# EAGLE design TV-B-Gone (EAGLE 7.5.0)
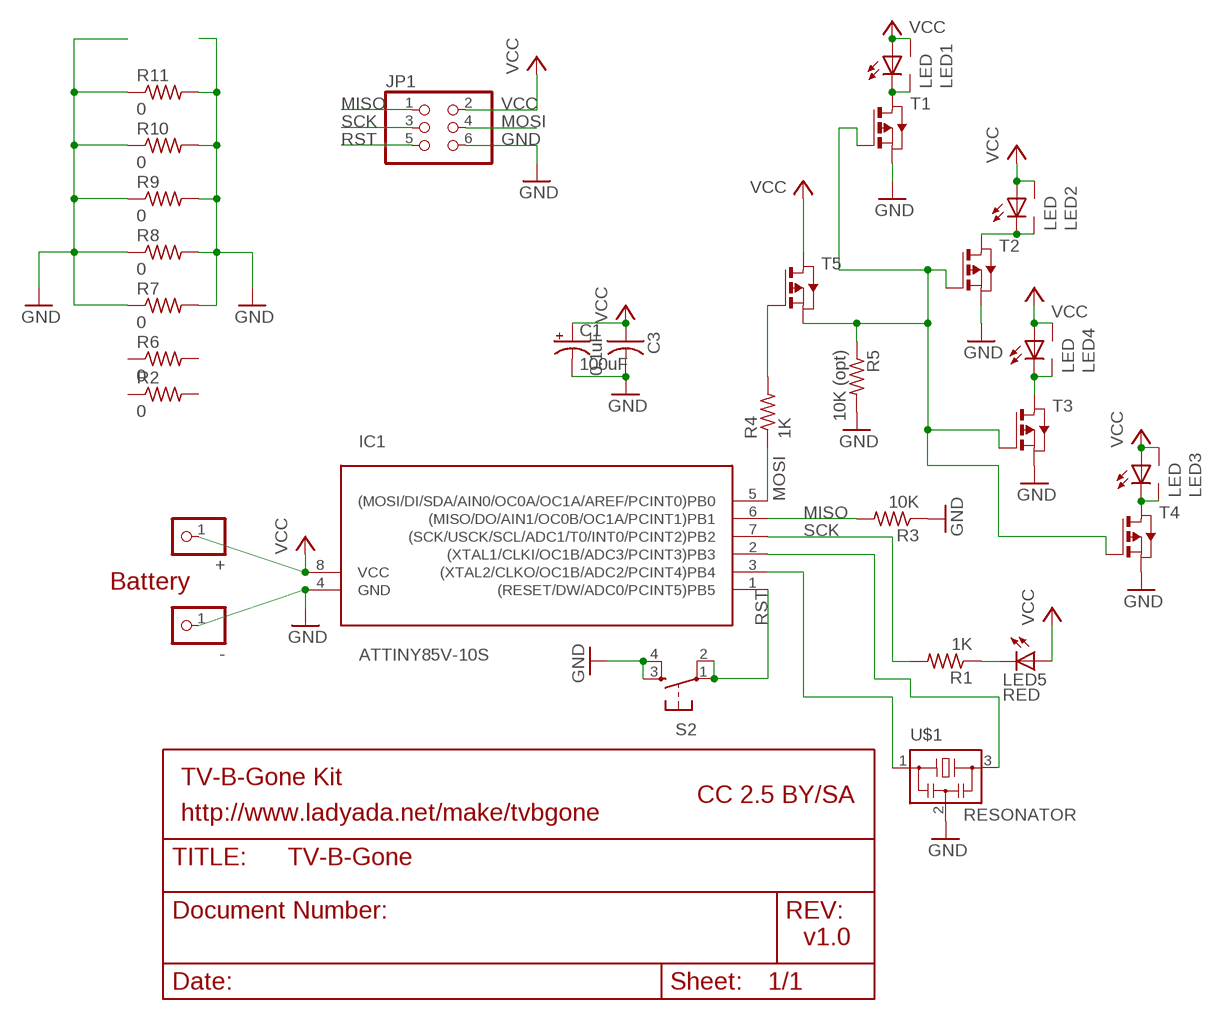
[diagram p0: schematic, sheet 1]

## Parts
+  PINHD-1X1  [1X01]
-  PINHD-1X1  [1X01]
C1  100uF  CAP_POLE  [PANASONIC_E]
C3  0.1uF  CAP-US1206FAB  [C1206FAB]
IC1  ATTINY85V-10S  [SOIC8]
JP1  PINHD-2X3-SMD  [2X03SMD]
LED1  LED  [5MM-SIDE]
LED2  LED  [5MM-SIDE]
LED3  LED  [5MM-SIDE]
LED4  LED  [5MM-SIDE]
LED5  RED  LEDCHIPLED_1206  [CHIPLED_1206]
R1  1K  RES-US1206FAB  [R1206FAB]
R2  0  RES-US1206FAB  [R1206FAB]
R3  10K  RES-US1206FAB  [R1206FAB]
R4  1K  RES-US1206FAB  [R1206FAB]
R5  10K (opt)  RES-US1206FAB  [R1206FAB]
R6  0  RES-US1206FAB  [R1206FAB]
R7  0  RES-US1206FAB  [R1206FAB]
R8  0  RES-US1206FAB  [R1206FAB]
R9  0  RES-US1206FAB  [R1206FAB]
R10  0  RES-US1206FAB  [R1206FAB]
R11  0  RES-US1206FAB  [R1206FAB]
S2  6MM_SWITCH6MM_SWITCH  [6MM_SWITCH]
T1  PMOSFETSOT23  [SOT-23]
T2  PMOSFETSOT23  [SOT-23]
T3  PMOSFETSOT23  [SOT-23]
T4  PMOSFETSOT23  [SOT-23]
T5  PMOSFETSOT23  [SOT-23]
U$1  RESONATOR  [EFOBM]

## Nets
GND: -.1 C1.- C3.2 IC1.4(GND) JP1.6 R3.1 R5.2 R7.1 R7.2 R8.1 R8.2 R9.1 R9.2 R10.1 R10.2 R11.1 R11.2 S2.3(S) S2.4(S1) T1.2(S) T2.2(S) T3.2(S) T4.2(S) U$1.2
MISO: IC1.6((MISO/DO/AIN1/OC0B/OC1A/PCINT1)PB1) JP1.1 R3.2
MOSI: IC1.5((MOSI/DI/SDA/AIN0/OC0A/OC1A/AREF/PCINT0)PB0) JP1.4 R4.1
N$1: IC1.3((XTAL2/CLKO/OC1B/ADC2/PCINT4)PB4) U$1.1
N$2: IC1.2((XTAL1/CLKI/OC1B/ADC3/PCINT3)PB3) U$1.3
N$3: LED5.C R1.1
N$6: R4.2 T5.3(G)
N$7: LED4.K2(C1) LED4.K(C) T3.1(D)
N$8: LED2.K2(C1) LED2.K(C) T2.1(D)
N$9: LED3.K2(C1) LED3.K(C) T4.1(D)
N$10: R5.1 T1.3(G) T2.3(G) T3.3(G) T4.3(G) T5.2(S)
N$11: LED1.K2(C1) LED1.K(C) T1.1(D)
RST: IC1.1((RESET/DW/ADC0/PCINT5)PB5) JP1.5 S2.1(P) S2.2(P1)
SCK: IC1.7((SCK/USCK/SCL/ADC1/T0/INT0/PCINT2)PB2) JP1.3 R1.2
VCC: +.1 C1.+ C3.1 IC1.8(VCC) JP1.2 LED1.A LED1.A2(A1) LED2.A LED2.A2(A1) LED3.A LED3.A2(A1) LED4.A LED4.A2(A1) LED5.A T5.1(D)
Unconnected: R2.1 R2.2 R6.1 R6.2

## Notes on the sheet
- Battery
- TV-B-Gone Kit
- CC 2.5 BY/SA
- http://www.ladyada.net/make/tvbgone
- v1.0

## Library data of the parts
+ - = ybox2:PINHD-1X1: PIN HEADER
C1 = SparkFun-Capacitors:CAP_POL: Capacitor Polarized These are standard SMD and PTH capacitors. Normally 10uF, 47uF, and 100uF in electrolytic and tantalum varieties. Always verify the external diameter of the through hole cap, it varies with capacity, voltage, and manufacturer. The EIA devices should be standard.
C3 = fab:CAP-US
IC1 = avr:ATTINY85: MICROCONTROLLER 8 Kbytes FLASH 512 bytes EEPROM 512 bytes RAM 4-channel 10 bit ADC USI
JP1 = fab:PINHD-2X3-SMD: PIN HEADER
LED1-LED4 = tvbgone:LED
LED5 = minimidi:LED: LED OSRAM: - CHIPLED LG R971, LG N971, LY N971, LG Q971, LY Q971, LO R971, LY R971 LH N974, LH R974 LS Q976, LO Q976, LY Q976 LO Q996 - Hyper CHIPLED LW Q18S LB Q993, LB Q99A, LB R99A - SideLED LS A670, LO A670, LY A670, LG A670, LP A670 LB A673, LV A673, LT A673, LW A673 LH A674 LY A675 LS A676, LA A676, LO A676, LY A676, LW A676 LS A679, LY A679, LG A679 - Hyper Micro SIDELED® LS Y876, LA Y876, LO Y876, LY Y876 LT Y87S - SmartLED LW L88C, LW L88S LB L89C, LB L89S, LG L890 LS L89K, LO L89K, LY L89K LS L896, LA L896, LO L896, LY L896 - TOPLED LS T670, LO T670, LY T670, LG T670, LP T670 LSG T670, LSP T670, LSY T670, LOP T670, LYG T670 LG T671, LOG T671, LSG T671 LB T673, LV T673, LT T673, LW T673 LH T674 LS T676, LA T676, LO T676, LY T676, LB T676, LH T676, LSB T676, LW T676 LB T67C, LV T67C, LT T67C, LS T67K, LO T67K, LY T67K, LW E67C LS E67B, LA E67B, LO E67B, LY E67B, LB E67C, LV E67C, LT E67C LW T67C LS T679, LY T679, LG T679 LS T770, LO T770, LY T770, LG T770, LP T770 LB T773, LV T773, LT T773, LW T773 LH T774 LS E675, LA E675, LY E675, LS T675 LS T776, LA T776, LO T776, LY T776, LB T776 LHGB T686 LT T68C, LB T68C - Hyper Mini TOPLED® LB M676 - Mini TOPLED Santana® LG M470 LS M47K, LO M47K, LY M47K Source: http://www.osram.convergy.de/
R1-R11 = fab:RES-US: Resistor (US Symbol) Variants with postfix FAB are widened to allow the routing of internal traces
S2 = fab:6MM_SWITCH: OMRON SWITCH
T1-T5 = fab:PMOSFET: MOS FET
U$1 = fab:RESONATOR

## Board
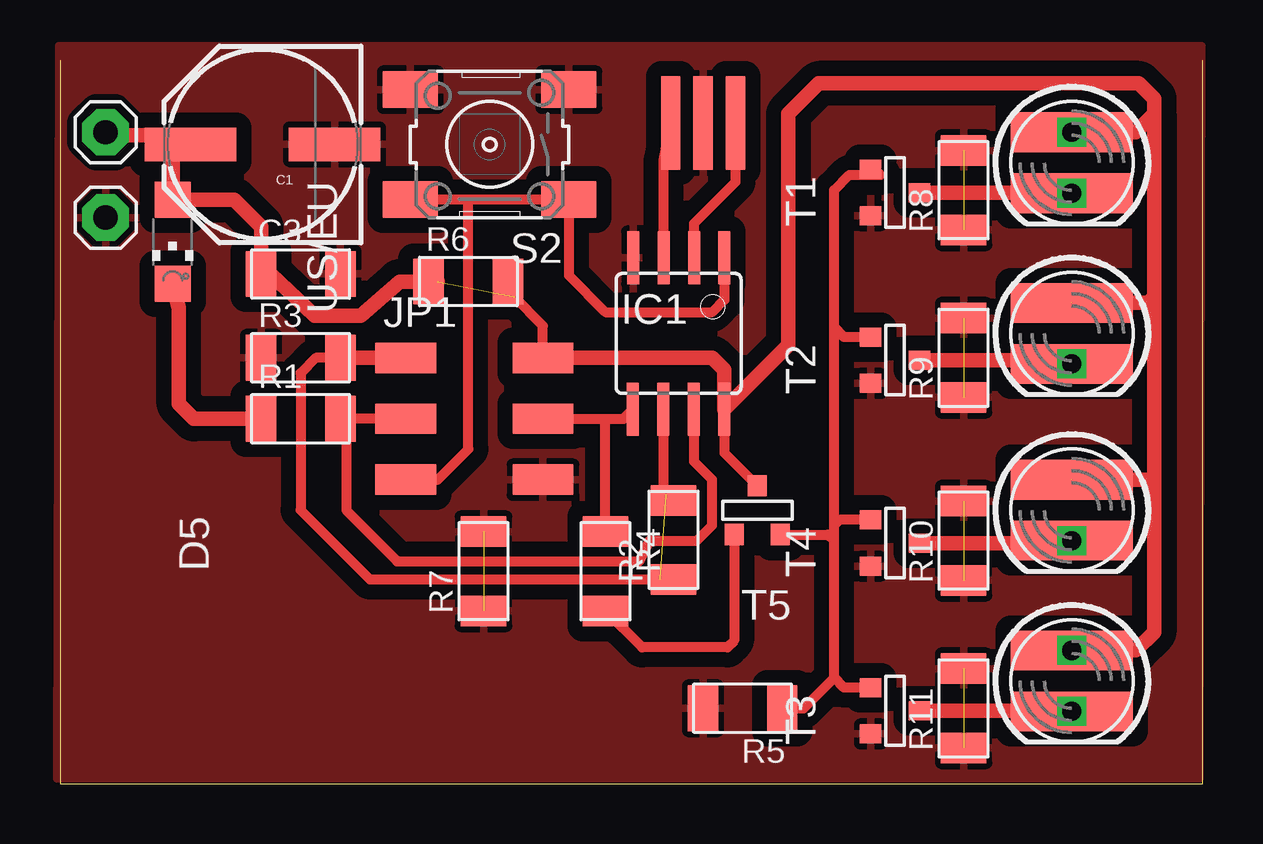
[diagram p1: board, top side]
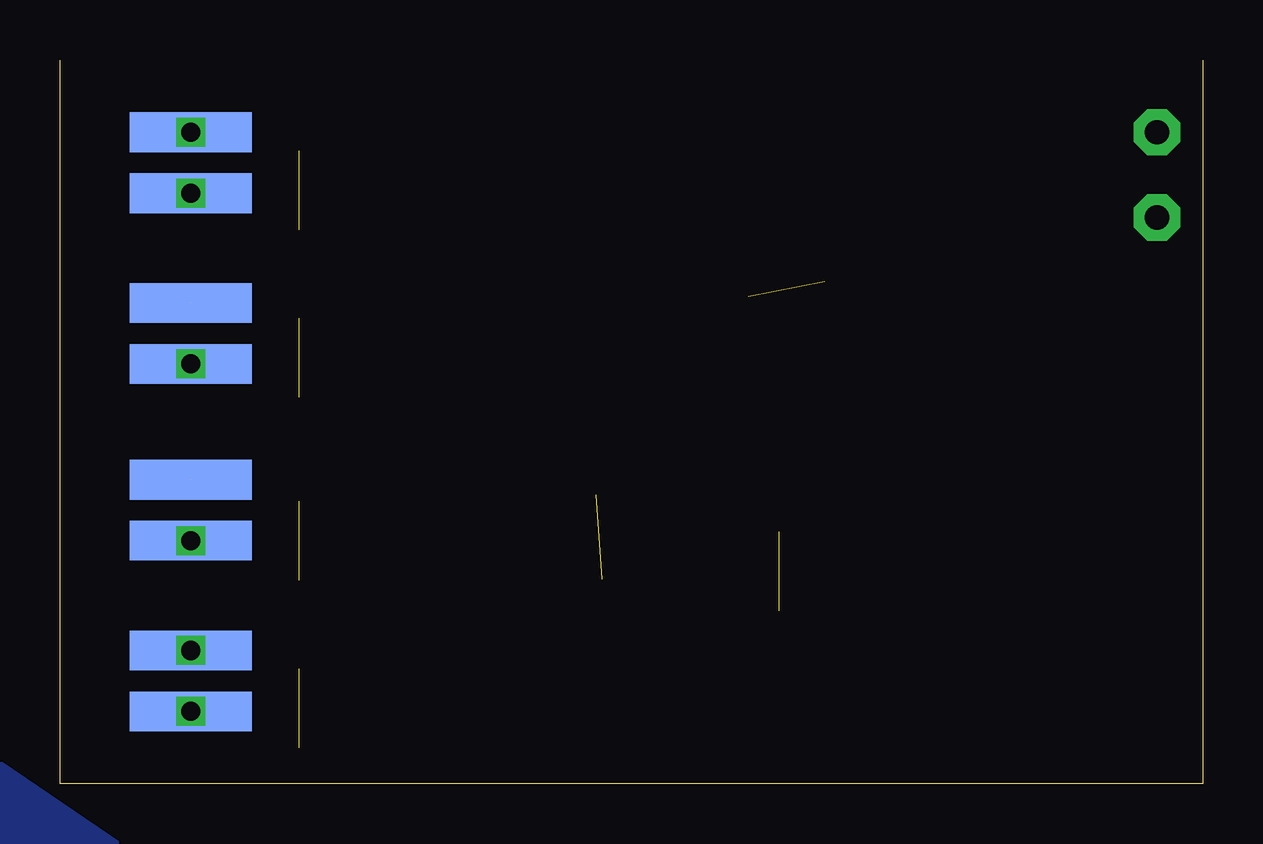
[diagram p2: board, bottom side, seen from below]

Size 47.61 x 30.15 mm. Coordinates in mm from the lower left corner, seen from the top.
Outline: 47.61,30.15 47.61,0 0,0 0,30.15
Copper layers (1*16): Top 0.035mm / dielectric 1.5mm / Bottom 0.035mm
Design rules "default": minimum track width 10mil, minimum drill 20mil, track to track 12mil, track to pad 12mil, pad to pad 12mil, via to via 12mil, smd to smd 0mil, copper to edge 0mil, drill to drill 8mil, minimum pad ring 10mil, minimum via ring 8mil, stop-mask expansion 4mil, vias tented up to drill 0mil, thermal gap 10mil

### Footprints (pad centres in the part's own frame; a part is rotated, then mirrored left to right if it is on the bottom)
1X01 = drill 1.016 pad 1.93 octagon: 1 0,0
PANASONIC_E = smd 3.8 x 1.4: + 3,0; - -3,0
C1206FAB = smd 1.27 x 1.905: 1 -1.651,0; 2 1.651,0
SOIC8 = smd 0.5 x 2.2: 1 -1.905,-3.154; 2 -0.645,-3.154; 3 0.625,-3.154; 4 1.895,-3.154; 5 1.905,3.154; 6 0.635,3.154; 7 -0.635,3.154; 8 -1.905,3.154
2X03SMD = smd 2.54 x 1.27: 1 -2.857,2.54; 2 2.857,2.54; 3 -2.857,0; 4 2.857,0; 5 -2.857,-2.54; 6 2.857,-2.54
5MM-SIDE = smd 1.651 x 5.08: A -1.27,0; K 1.27,0 | smd 1.651 x 5.08 bottom: A2 -1.27,0; K2 1.27,0
CHIPLED_1206 = smd 1.5 x 1.5: A 0,-1.75; C 0,1.75
R1206FAB = smd 1.27 x 1.905: 1 -1.651,0; 2 1.651,0
6MM_SWITCH = smd 2.286 x 1.524: 1 -3.302,2.286; 2 3.302,2.286; 3 -3.302,-2.286; 4 3.302,-2.286
SOT-23 = smd 0.787 x 0.889: 1 0.025,-1.016; 2 -0.94,1.016; 3 0.991,1.016
EFOBM = smd 0.8 x 3.9: 1 -1.35,0; 2 0,0; 3 1.35,0

### Placement (x,y rotation side)
+  1.9,27.14 0 top
-  1.9,23.58 0 top
C1  8.44,26.63 180 top
C3  10.03,21.23 0 top
IC1  25.78,18.76 180 top
JP1  17.27,15.2 0 top
LED1  42.16,25.87 270 top
LED2  42.16,18.76 270 top
LED3  42.16,11.39 270 top
LED4  42.16,4.28 270 top
LED5  4.69,22.57 180 top
R1  10.03,15.2 0 top
R2  25.56,10.15 90 top
R3  10.03,17.74 0 top
R4  22.73,8.85 270 top
R5  28.44,3.14 180 top
R6  17.01,20.92 0 top
R7  17.65,8.85 90 top
R8  37.65,24.73 90 top
R9  37.65,17.74 90 top
R10  37.65,10.12 90 top
R11  37.65,3.14 90 top
S2  17.9,26.63 180 top
T1  34.79,24.6 90 top
T2  34.79,17.61 90 top
T3  34.79,3.01 90 top
T4  34.79,9.99 90 top
T5  29.08,11.39 180 top
U$1  26.79,27.52 0 top

### Tracks (layer width: path | path; a pad name or v marks a point on that pad's centre or on a via)
GND  (5 unrouted)
  Top 0.406: JP1.6 20.19,12.66
  pour Top (isolate 0.635): -0.05,30.75 -0.13,0.2 47.49,0.2 47.57,30.75
MISO  (1 unrouted)
  Top 0.406: JP1.1 10.66,17.74 10.03,17.11 10.03,11.39 12.91,8.51 25.01,8.51 | IC1.6 25.14,12.15 25.27,12.03
  Top 0.61: JP1.1 R3.2 11.3,17.74
MOSI
  Top 0.406: JP1.4 22.73,15.2 | 22.73,15.2 23.47,15.2 IC1.5 | R4.1 22.73,15.2
N$1
  Top 0.406: IC1.3 25.15,25.96 U$1.1
N$2
  Top 0.406: IC1.2 26.42,23.34 28.14,25.06 U$1.3
N$3
  Top 0.61: R1.1 5.58,15.2 4.95,15.84 4.95,19.8 LED5.C
N$6
  Top 0.406: T5.3 28.09,5.96 27.81,5.68 24.25,5.68 R4.2
N$7  (via drill 0.8)
  Top 0.61: T3.1 41.5,3.04 LED4.K2
  other vias: 42.16,3.01
N$8  (via drill 0.8)
  Top 0.61: T2.1 41.37,17.64 LED2.K2
  Bottom 0.305: LED2.K2 41.78,17.49
  other vias: 42.16,17.49
N$9  (via drill 0.8)
  Top 0.61: T4.1 41.42,10.02 LED3.K2
  Bottom 0.305: LED3.K2 41.78,10.12
  other vias: 42.16,10.12
N$10
  Top 0.406: T3.3 32.66,4 32.25,4.41 | 32.25,4.41 32.25,10.12 | 32.25,10.12 32.25,10.76 | 32.25,10.76 32.25,19.01 | 32.25,19.01 32.25,24.73 32.89,25.36 34.18,25.36 T1.3 | T4.3 32.48,10.99 32.25,10.76 | T2.3 32.66,18.61 32.25,19.01 | T5.2 32,10.38 32.25,10.12 | R5.1 30.98,3.14 32.25,4.41
N$11  (via drill 0.8)
  Top 0.61: T1.1 41.5,24.62 LED1.K2
  other vias: 42.16,24.6
RST
  Top 0.406: IC1.1 27.68,20.16 27.17,19.65 22.73,19.65 21.2,21.17 S2.1 17.01,24.35 | JP1.5 15.74,12.66 17.01,13.93 17.01,24.35 | S2.2 17.01,24.35
SCK
  Top 0.406: R1.2 11.93,15.2 | JP1.3 11.93,15.2 | 11.93,15.2 11.93,11.39 14.03,9.29 14.03,9.26 24.13,9.26 24.57,10.12 26.54,10.12 27.17,10.76 27.17,12.66 26.41,13.42 IC1.7
VCC  (via drill 0.8)  (3 unrouted)
  Top 0.305: LED4.A2 41.52,5.8 41.78,5.55 LED4.A2
  Top 0.406: IC1.8 27.68,13.78 T5.1 | JP1.2 20.12,19.07 18.92,20.28 | 4.69,26.76 4.69,26.84 4.86,27.01
  Top 0.61: 45.59,27.9 45.59,28.54 44.95,29.17 31.62,29.17 30.35,27.9 30.35,18.27 IC1.8 27.68,17.23 27.17,17.74 JP1.2 | LED1.A2 44.83,27.14 45.59,27.9 | 45.59,27.9 45.59,20.28 | 45.59,20.28 45.59,12.66 | 45.59,12.66 45.59,6.31 44.83,5.55 LED4.A2 | LED2.A2 45.33,20.03 45.59,20.28 | LED3.A2 45.59,12.66 | +.1 2.03,27.01 4.86,27.01 5.24,26.63 C1.+ | 4.69,26.76 LED5.A 7.26,24.32 8.38,23.2 C3.1 8.76,21.23 10.62,19.49 12.52,19.49 14.16,20.92 15.74,20.92
  other vias: 42.16,27.14 42.16,5.55
  pour Bottom (isolate 0.406): 24.63,-16.55 51.94,-1.94 69.08,13.68

### Text on the board
tPlace: US/EU | IC1 | D5